# EAGLE design LC-204_DN-breakout (EAGLE 6.6.0)
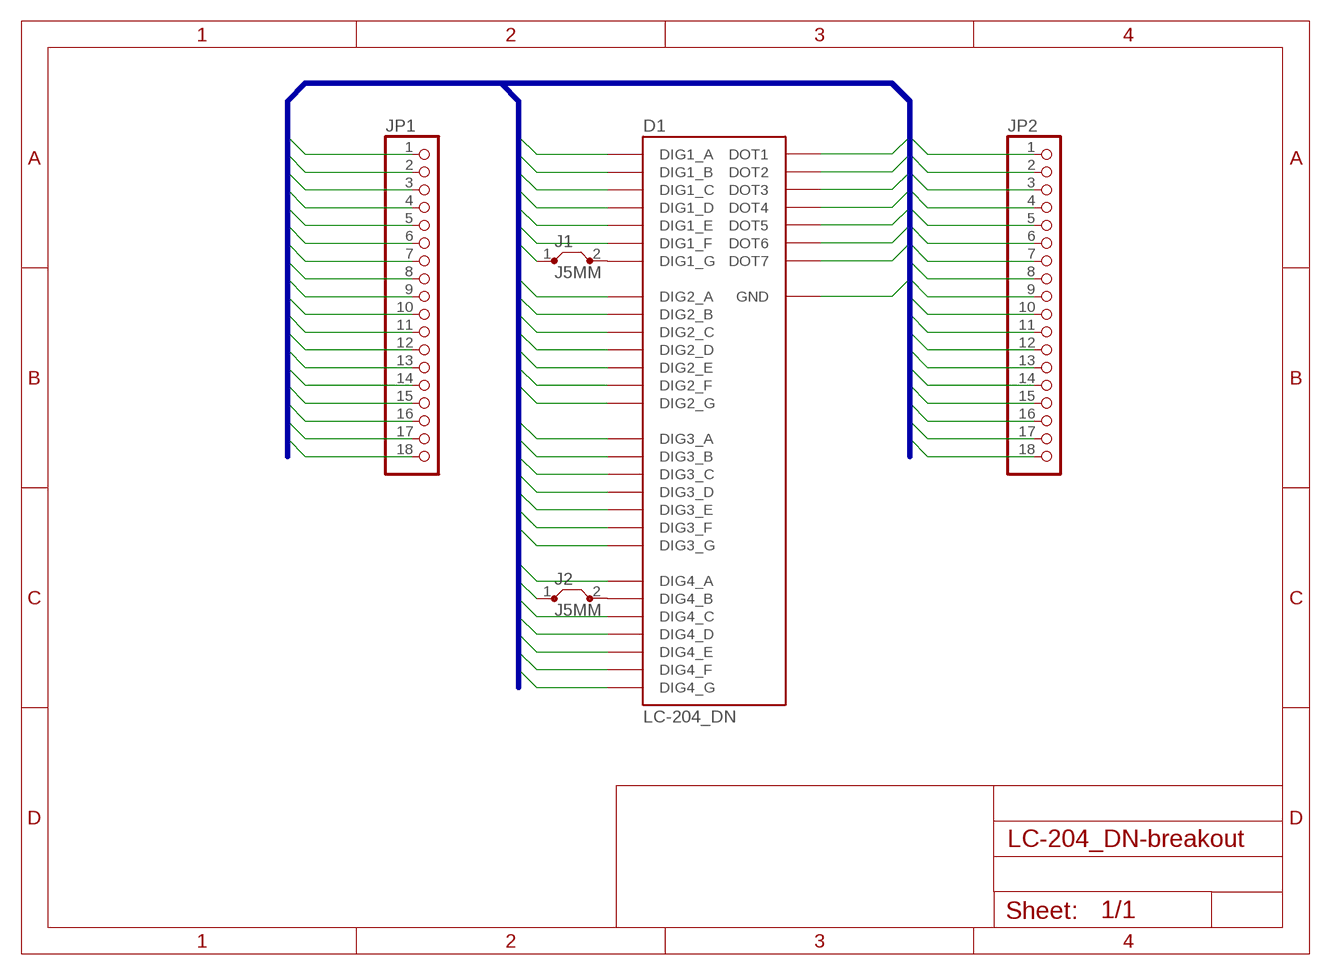
[diagram p0: schematic, sheet 1]

## Parts
D1  LC-204_DN  [LC-204_DN]
J1  J5MM  [05]
J2  J5MM  [05]
JP1  PINHD-1X18  [1X18]
JP2  PINHD-1X18  [1X18]

## Nets
DIG1_1: D1.DIG1_A JP2.4
DIG1_2: D1.DIG1_B JP2.5
DIG1_3: D1.DIG1_C JP1.4
DIG1_4: D1.DIG1_D JP1.3
DIG1_5: D1.DIG1_E JP1.2
DIG1_6: D1.DIG1_F JP2.3
DIG1_7: J1.1 JP2.2
DIG2_1: D1.DIG2_A JP2.8
DIG2_2: D1.DIG2_B JP2.9
DIG2_3: D1.DIG2_C JP1.7
DIG2_4: D1.DIG2_D JP1.6
DIG2_5: D1.DIG2_E JP1.5
DIG2_6: D1.DIG2_F JP2.7
DIG2_7: D1.DIG2_G JP2.6
DIG3_1: D1.DIG3_A JP2.12
DIG3_2: D1.DIG3_B JP2.13
DIG3_3: D1.DIG3_C JP1.12
DIG3_4: D1.DIG3_D JP1.11
DIG3_5: D1.DIG3_E JP1.9
DIG3_6: D1.DIG3_F JP2.11
DIG3_7: D1.DIG3_G JP1.10
DIG4_1: D1.DIG4_A JP2.16
DIG4_2: J2.1 JP2.17
DIG4_3: D1.DIG4_C JP1.16
DIG4_4: D1.DIG4_D JP1.15
DIG4_5: D1.DIG4_E JP1.14
DIG4_6: D1.DIG4_F JP2.15
DIG4_7: D1.DIG4_G JP2.14
DOT1: D1.DOT1 JP2.1
DOT2: D1.DOT2 JP1.1
DOT3: D1.DOT3 JP2.10
DOT4: D1.DOT4 JP1.8
DOT5: D1.DOT5 JP1.13
DOT6: D1.DOT6 JP2.18
DOT7: D1.DOT7 JP1.17
GND: D1.GND JP1.18
N$1: D1.DIG1_G J1.2
N$2: D1.DIG4_B J2.2

## Buses
DIG1_[1..7],DIG2_[1..7],DIG3_[1..7],DIG4_[1..7],DOT[1..7],GND

## Library data of the parts
D1 = mibe:LC-204_DN: LC-204 DN - The LC-204 series represents 4-digit LED numeric displays designed to take up a minimum of space. The character size is 6 mm, the pin arrangement spacing is 1.8 mm and the shape is the same as a DIL package.
J1 J2 = jumper:J: Bridge
JP1 JP2 = pinhead:PINHD-1X18: PIN HEADER

## Board
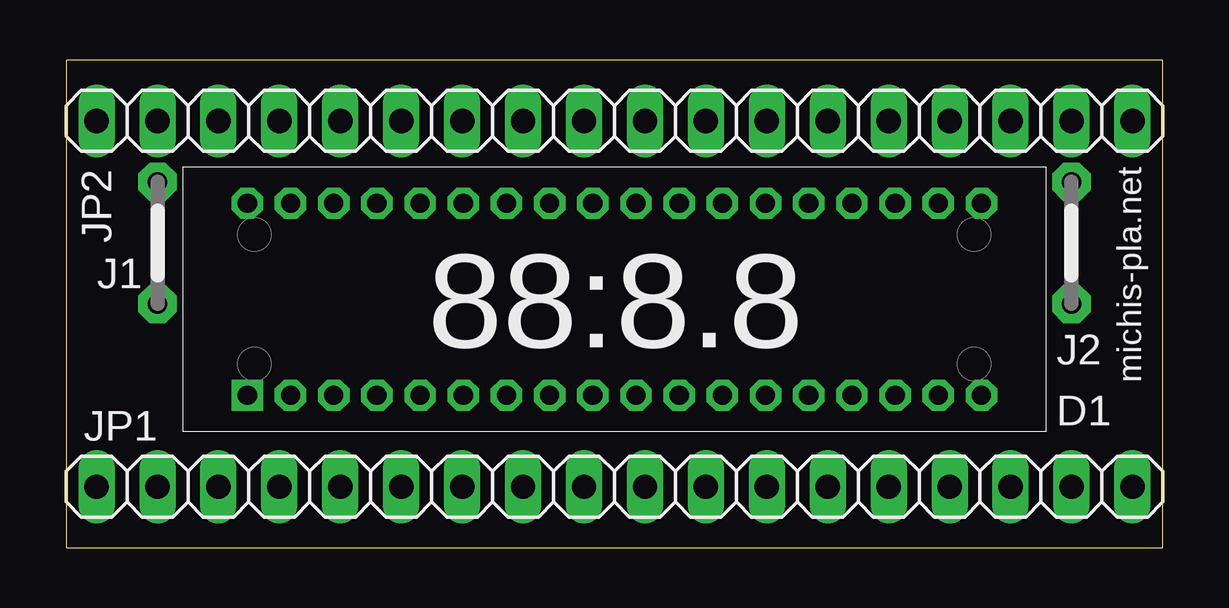
[diagram p1: board, top side]
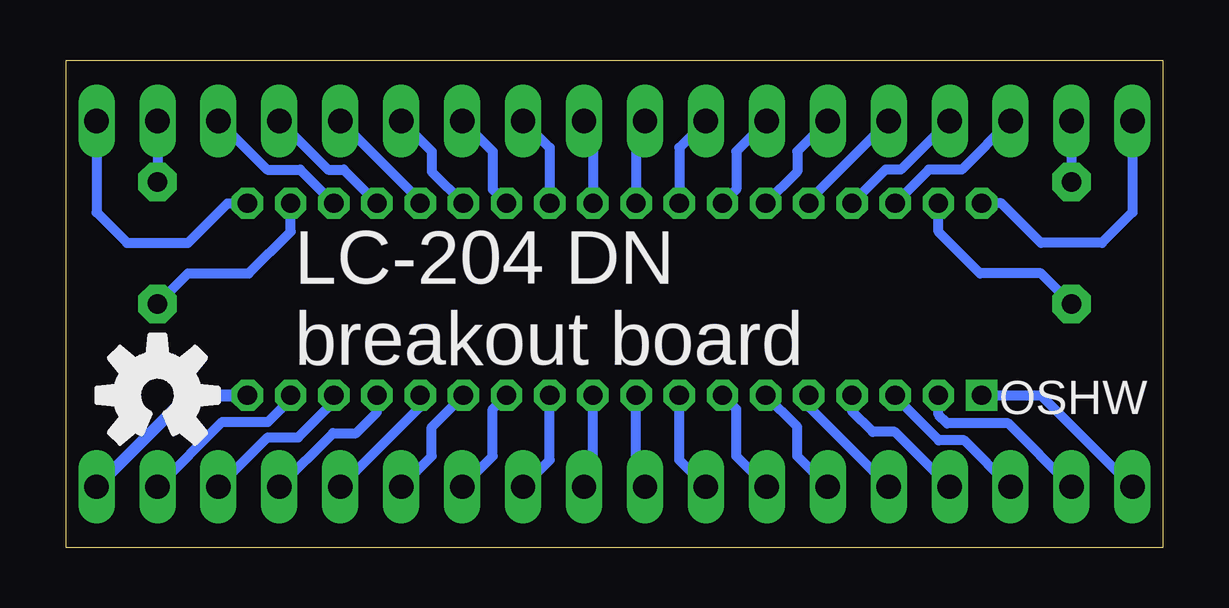
[diagram p2: board, bottom side, seen from below]

Size 45.72 x 20.32 mm. Coordinates in mm from the lower left corner, seen from the top.
Outline: 0,0 45.72,0 45.72,20.32 0,20.32 0,0
Copper layers (1*16): Top 0.035mm / dielectric 1.5mm / Bottom 0.035mm
Design rules "default": minimum track width 10mil, minimum drill 24mil, track to track 8mil, track to pad 8mil, pad to pad 8mil, via to via 8mil, smd to smd 8mil, copper to edge 40mil, drill to drill 8mil, minimum pad ring 10mil, minimum via ring 8mil, stop-mask expansion 4mil, vias tented up to drill 0mil, thermal gap 10mil

### Footprints (pad centres in the part's own frame; a part is rotated, then mirrored left to right if it is on the bottom)
LC-204_DN = drill 0.8 octagon: DIG1_A 5.4,4.19; DIG1_B 7.2,4.19; DIG1_C 5.4,-3.81; DIG1_D 3.6,-3.81; DIG1_E 1.8,-3.81; DIG1_F 3.6,4.19; DIG1_G 1.8,4.19; DIG2_A 12.6,4.19; DIG2_B 14.4,4.19; DIG2_C 10.8,-3.81; DIG2_D 9,-3.81; DIG2_E 7.2,-3.81; DIG2_F 10.8,4.19; DIG2_G 9,4.19; DIG3_A 19.8,4.19; DIG3_B 21.6,4.19; DIG3_C 19.8,-3.81; DIG3_D 18,-3.81; DIG3_E 14.4,-3.81; DIG3_F 18,4.19; DIG3_G 16.2,-3.81; DIG4_A 27,4.19; DIG4_B 28.8,4.19; DIG4_C 27,-3.81; DIG4_D 25.2,-3.81; DIG4_E 23.4,-3.81; DIG4_F 25.2,4.19; DIG4_G 23.4,4.19; DOT1 0,4.19; DOT3 16.2,4.19; DOT4 12.6,-3.81; DOT5 21.6,-3.81; DOT6 30.6,4.19; DOT7 28.8,-3.81; GND 30.6,-3.81 | drill 0.8 square: DOT2 0,-3.81
05 = drill 0.813 pad 1.6 octagon: 1 -2.54,0; 2 2.54,0
1X18 = drill 1.016 long: 1 -21.59,0; 2 -19.05,0; 3 -16.51,0; 4 -13.97,0; 5 -11.43,0; 6 -8.89,0; 7 -6.35,0; 8 -3.81,0; 9 -1.27,0; 10 1.27,0; 11 3.81,0; 12 6.35,0; 13 8.89,0; 14 11.43,0; 15 13.97,0; 16 16.51,0; 17 19.05,0; 18 21.59,0

### Placement (x,y rotation side)
D1  7.56,10.16 0 top
J1  3.81,12.7 270 top
J2  41.91,12.7 270 top
JP1  22.86,2.54 0 top
JP2  22.86,17.78 0 top

### Tracks (layer width: path | path; a pad name or v marks a point on that pad's centre or on a via)
DIG1_1
  Bottom 0.406: JP2.4 10.92,15.75 11.56,15.75 D1.DIG1_A
DIG1_2
  Bottom 0.406: JP2.5 14.76,14.45 D1.DIG1_B
DIG1_3
  Bottom 0.406: JP1.4 11.18,4.83 12.09,4.83 12.96,5.69 D1.DIG1_C
DIG1_4
  Bottom 0.406: JP1.3 8.28,4.47 9.35,4.47 11.16,6.28 D1.DIG1_D
DIG1_5
  Bottom 0.406: JP1.2 6.45,5.18 8.99,5.18 9.36,5.55 D1.DIG1_E
DIG1_6
  Bottom 0.406: JP2.3 8.38,15.75 9.76,15.75 D1.DIG1_F
DIG1_7
  Bottom 0.406: JP2.2 J1.1
DIG2_1
  Bottom 0.406: JP2.8 20.16,16.67 D1.DIG2_A
DIG2_2
  Bottom 0.406: JP2.9 21.96,17.41 D1.DIG2_B
DIG2_3
  Bottom 0.406: JP1.7 17.78,3.81 17.78,5.77 D1.DIG2_C
DIG2_4
  Bottom 0.406: JP1.6 15.24,3.81 15.24,5.03 D1.DIG2_D
DIG2_5
  Bottom 0.406: JP1.5 14.76,5.87 D1.DIG2_E
DIG2_6
  Bottom 0.406: JP2.7 17.78,16.51 17.78,14.93 D1.DIG2_F
DIG2_7
  Bottom 0.406: JP2.6 15.24,16.51 15.24,15.67 D1.DIG2_G
DIG3_1
  Bottom 0.406: JP2.12 27.94,16.51 27.94,14.93 D1.DIG3_A
DIG3_2
  Bottom 0.406: JP2.13 30.48,16.51 30.48,15.67 D1.DIG3_B
DIG3_3
  Bottom 0.406: JP1.12 27.94,3.81 27.94,5.77 D1.DIG3_C
DIG3_4
  Bottom 0.406: JP1.11 25.56,3.65 D1.DIG3_D
DIG3_5
  Bottom 0.406: JP1.9 21.96,2.91 D1.DIG3_E
DIG3_6
  Bottom 0.406: JP2.11 25.56,16.67 D1.DIG3_F
DIG3_7
  Bottom 0.406: JP1.10 23.76,2.91 D1.DIG3_G
DIG4_1
  Bottom 0.406: JP2.16 37.34,15.75 35.96,15.75 D1.DIG4_A
DIG4_2
  Bottom 0.406: JP2.17 J2.1
DIG4_3
  Bottom 0.406: JP1.16 37.31,4.6 36.04,4.6 34.56,6.08 D1.DIG4_C
DIG4_4
  Bottom 0.406: JP1.15 34.59,4.78 33.63,4.78 32.76,5.65 D1.DIG4_D
DIG4_5
  Bottom 0.406: JP1.14 30.96,5.87 D1.DIG4_E
DIG4_6
  Bottom 0.406: JP2.15 34.8,15.75 34.14,15.75 34.14,15.73 D1.DIG4_F
DIG4_7
  Bottom 0.406: JP2.14 30.96,14.45 D1.DIG4_G
DOT1
  Bottom 0.406: JP2.1 1.27,13.97 2.54,12.7 5.08,12.7 6.73,14.35 D1.DOT1
DOT2
  Bottom 0.406: D1.DOT2 5.08,6.35 JP1.1
DOT3
  Bottom 0.406: JP2.10 23.76,17.41 D1.DOT3
DOT4
  Bottom 0.406: JP1.8 20.16,3.65 D1.DOT4
DOT5
  Bottom 0.406: JP1.13 30.48,3.81 30.48,5.03 D1.DOT5
DOT6
  Bottom 0.406: JP2.18 44.45,13.97 43.18,12.7 40.64,12.7 38.99,14.35 D1.DOT6
DOT7
  Bottom 0.406: JP1.17 39.2,5.25 37.3,5.25 36.36,6.19 D1.DOT7
GND
  Bottom 0.508: JP1.18 40.64,6.35 D1.GND
N$1
  Bottom 0.406: J1.2 5.08,11.43 7.62,11.43 9.36,13.17 D1.DIG1_G
N$2
  Bottom 0.406: J2.2 40.64,11.43 38.1,11.43 36.36,13.17 D1.DIG4_B

### Text on the board
tPlace: michis-pla.net
bPlace: LC-204 DN / breakout board | OSHW